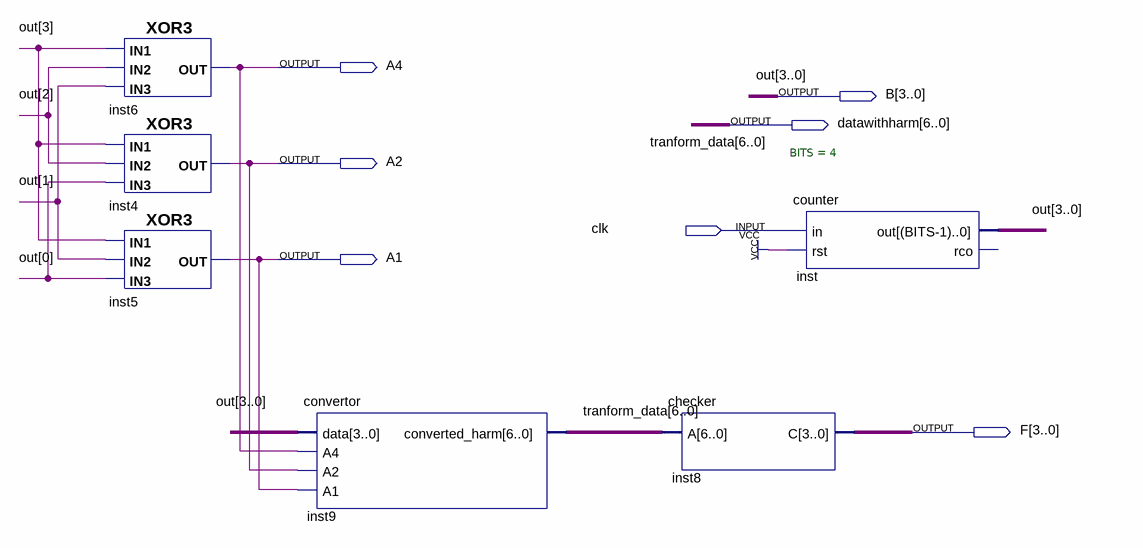
[diagram p0: schematic sheet]
// Quartus schematic MyHamming.bdf as structural Verilog: 6 symbols, 7 pins
module MyHamming (
  input  clk,
  output A4,
  output [3:0] B,
  output [6:0] datawithharm,
  output A2,
  output A1,
  output [3:0] F
);

  XOR3 inst6 (.IN3(B[1]), .IN1(B[3]), .IN2(B[2]), .OUT(A4));
  XOR3 inst4 (.IN3(B[0]), .IN1(B[3]), .IN2(B[2]), .OUT(A2));
  XOR3 inst5 (.IN3(B[0]), .IN1(B[3]), .IN2(B[1]), .OUT(A1));
  convertor inst9 (.data(B), .A4(A4), .A2(A2), .A1(A1), .converted_harm(datawithharm));
  \checker  inst8 (.A(datawithharm), .C(F));
  counter #(.BITS(4)) inst (.in(clk), .rst(1'b1), .out(B));  // open: rco

  // Other names for the same wires on the sheet: out[3:0] = B; tranform_data[6:0] = datawithharm
endmodule
